# EasyEDA Pro project P1.epro

# Schematic 51board_Schematic
Board Name: Board1; Create Date: 2024-12-11; Page Name: P1; Project Name: 51board; Schematic Name: 51board_Schematic; Update Date: 2024-12-11; Company: DUOBAO; Drawed: yunshu; Page Size: A4; Version: V1.0
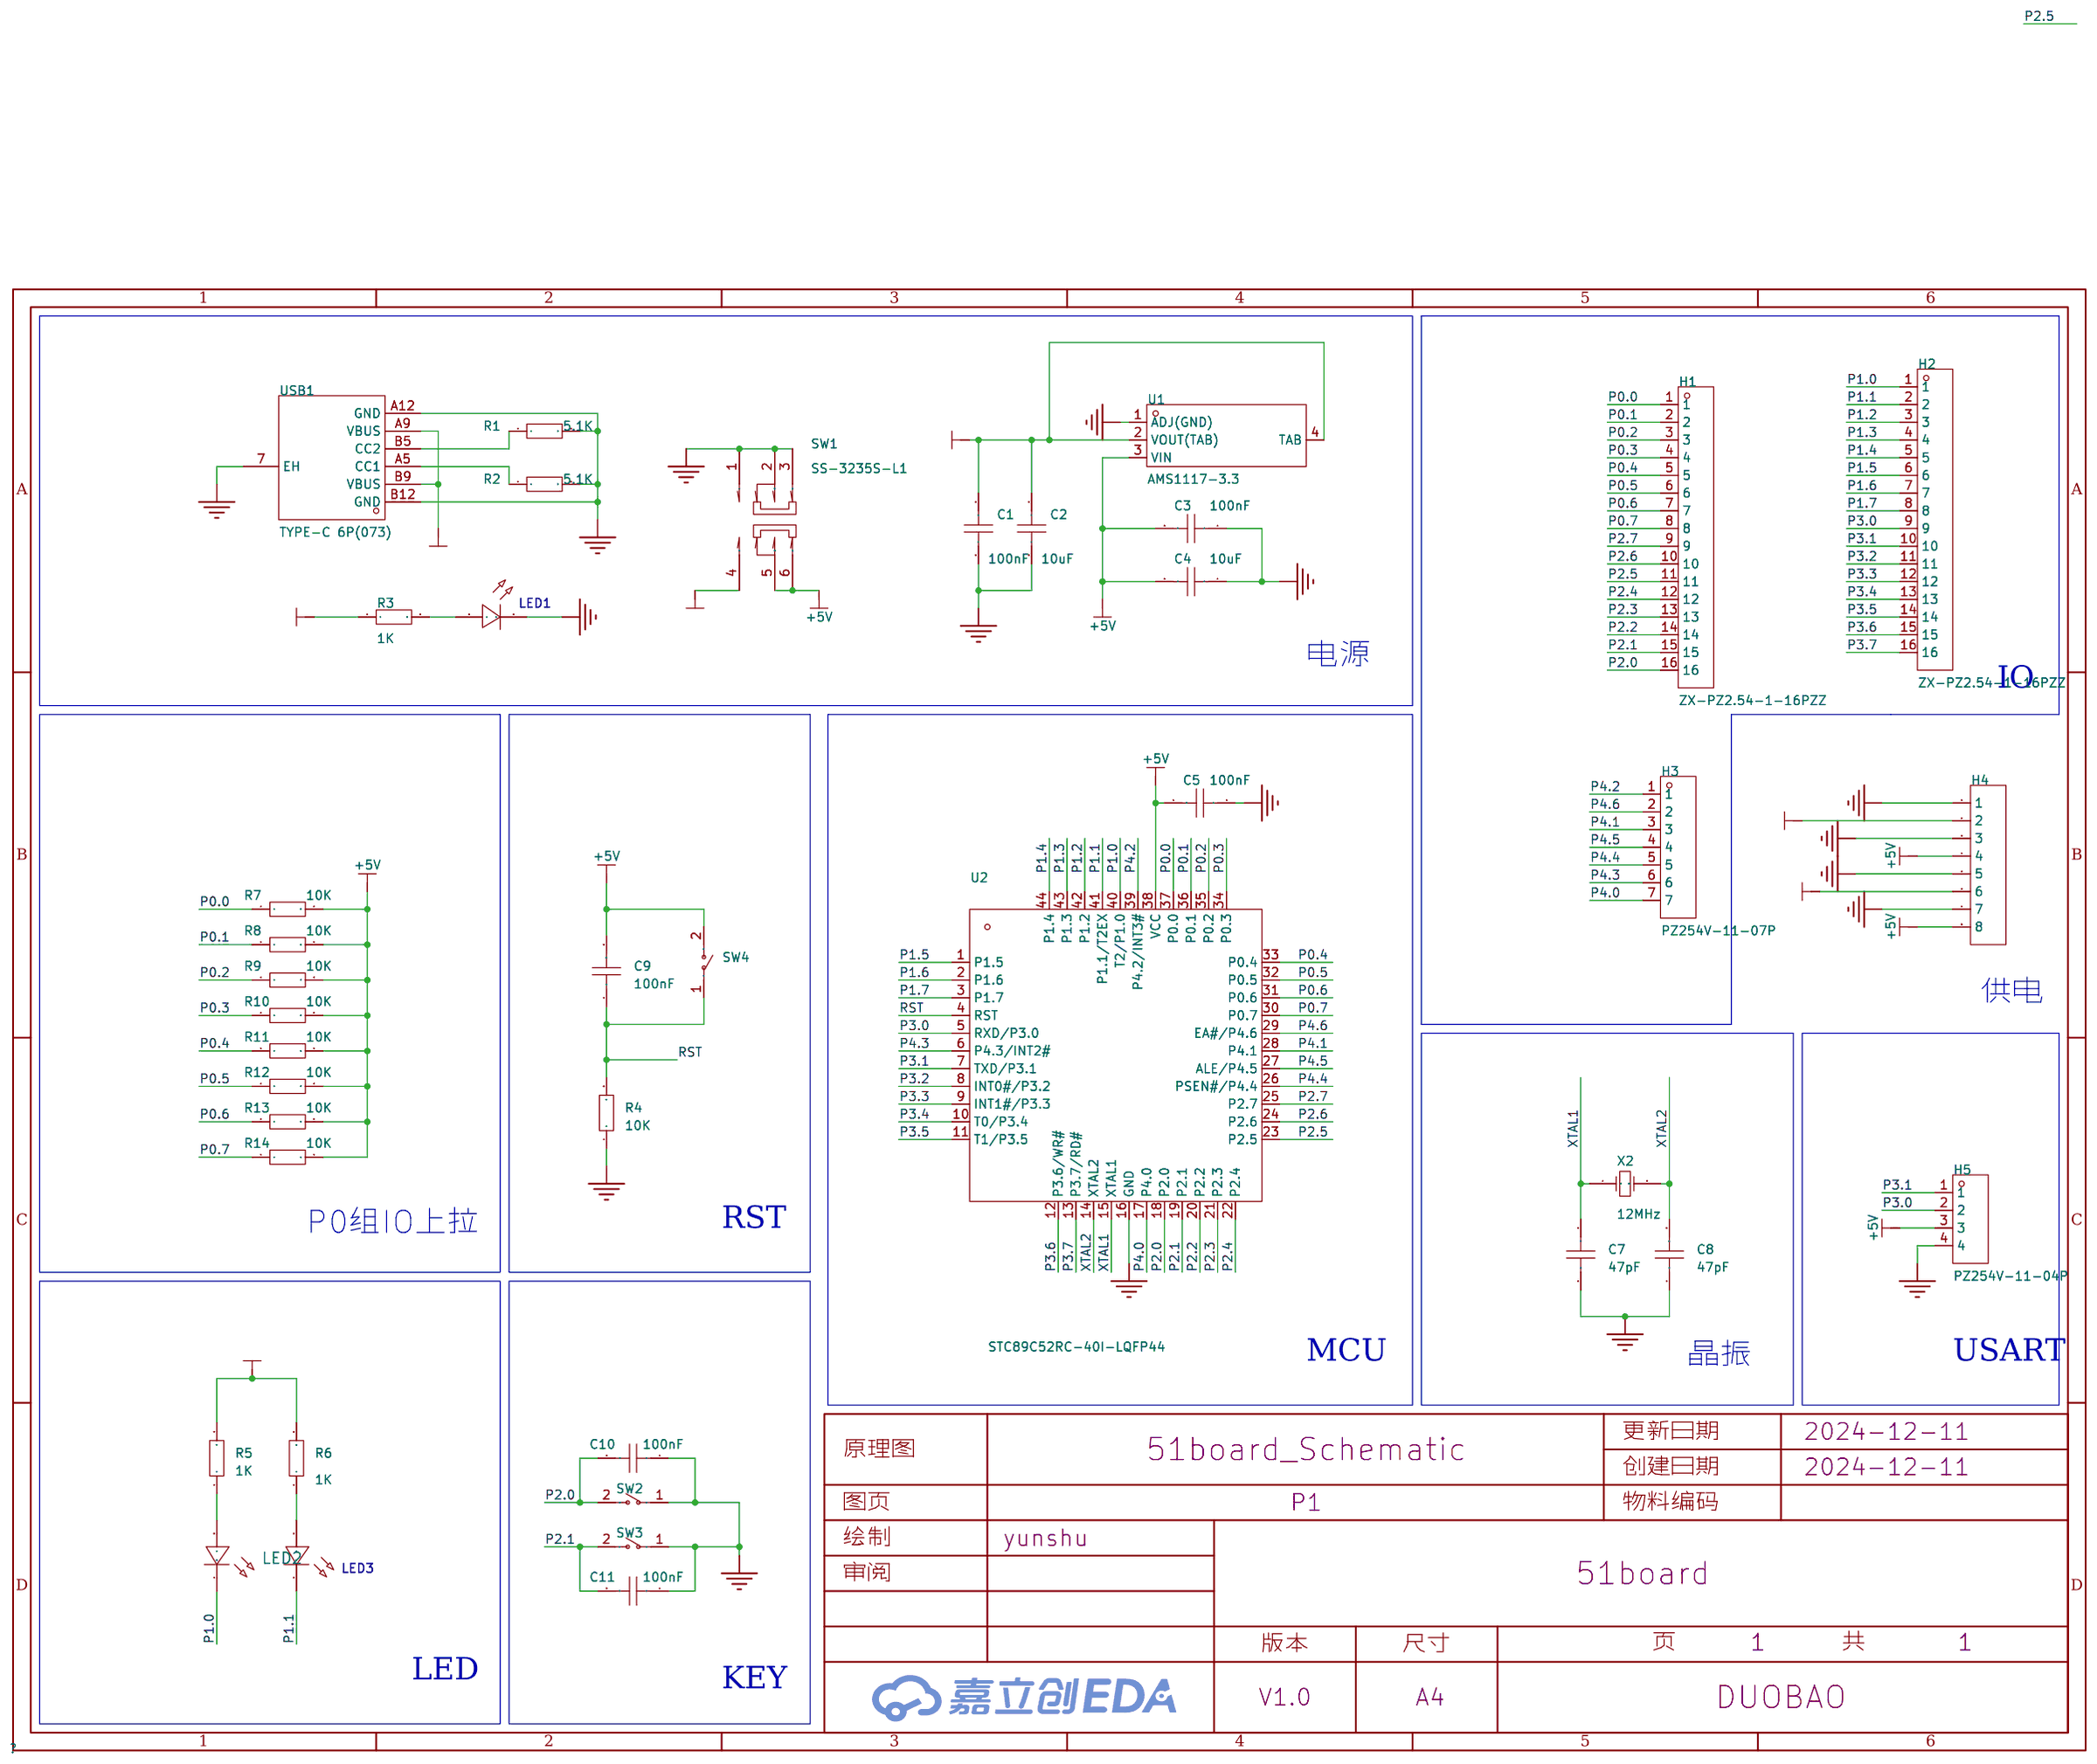
[diagram p0: schematic sheet]

## Parts
C1  100nF  [C0805]
C2  10uF  [C0805]
C3  100nF  [C0805]
C4  10uF  [C0805]
C5  100nF  [C0805]
C7  47pF  [C0805]
C8  47pF  [C0805]
C9  100nF  [C0805]
C10  100nF  [C0805]
C11  100nF  [C0805]
H1  ZX-PZ2.54-1-16PZZ  [HDR-TH_16P-P2.54-V-M-2]
H2  ZX-PZ2.54-1-16PZZ  [HDR-TH_16P-P2.54-V-M-2]
H3  PZ254V-11-07P  [HDR-TH_7P-P2.54-V-M]
H4  -  [HDR-TH_8P-P2.54-V-F-1]
H5  PZ254V-11-04P  [HDR-TH_4P-P2.54-V-M]
LED1  -  [LED_0805]
LED2  -  [LED_0805]
LED3  -  [LED_0805]
R1  5.1K  [R0805]
R2  5.1K  [R0805]
R3  1K  [R0805]
R4  10K  [R0805]
R5  1K  [R0805]
R6  1K  [R0805]
R7  10K  [R0805]
R8  10K  [R0805]
R9  10K  [R0805]
R10  10K  [R0805]
R11  10K  [R0805]
R12  10K  [R0805]
R13  10K  [R0805]
R14  10K  [R0805]
SW1  SS-3235S-L1  [SW-SMD_SS-3235S-LX]
SW2  轻触按键 3x6x2.5mm  [SW-SMD_L6.1-W3.7-LS8.0]
SW3  轻触按键 3x6x2.5mm  [SW-SMD_L6.1-W3.7-LS8.0]
SW4  轻触按键 3x6x2.5mm  [SW-SMD_L6.1-W3.7-LS8.0]
U1  AMS1117-3.3  [SOT-223-4_L6.5-W3.5-P2.30-LS7.0-BR]
U2  STC89C52RC-40I-LQFP44  [LQFP-44_L10.0-W10.0-P0.80-LS12.0-BL]
USB1  TYPE-C 6P(073)  [TYPE-C-SMD_TYPE-C-6P_5]
X2  12MHz  [OSC-TH_BD2.0-P0.50]

## Library data of the parts
C1-C5 C7-C11 = CAP_0805: Supplier Footprint: 0805
H1 H2 = ZX-PZ2.54-1-16PZZ: 插针结构:1x16P;间距:2.54mm;行距:-;圆针/方针:方针;安装类型:直插;排数:单排;总PIN位数:16P;额定电流:3A;额定电压:1kV;配合针长度:6mm;塑高:2.5mm;端接针长度:3mm;触头材质:黄铜;触头镀层:金;工作温度范围:-40℃~+105℃;焊接温度(最大值):-;颜色:黑色;; LCSC Part Name: 1x16P 间距:2.54mm 方针 直插; Supplier Part: C7501270; Manufacturer: Megastar(兆星); Supplier Footprint: 插件,P=2.54mm; JLCPCB Part Class: Extended Part; Datasheet: https://atta.szlcsc.com/upload/public/pdf/source/20231122/E454B24BEC0C004E7BA34E686CD1994E.pdf; Supplier: LCSC; Pin Structure: 1x16P; Pitch: 2.54mm; Circluar Pins/Square Pins: 方针; Mounting Type: 直插; Number of Rows: 单排; Number of Pins: 16P; Current Rating (Max): 3A; Voltage Rating (Max): 1kV; Length of Mating Pin: 6mm; Insulation Height: 2.5mm; Length of End Connection Pin: 3mm; Contact Material: 黄铜; Contact Plating: 金; Operating Temperature Range: -40℃~+105℃; Color: 黑色
H3 = PZ254V-11-07P: 插针结构:1x7P;间距:2.54mm;行距:-;圆针/方针:方针;安装类型:直插;排数:单排;总PIN位数:7P;额定电流:-;额定电压:-;配合针长度:6mm;塑高:2.5mm;端接针长度:3mm;触头材质:黄铜;触头镀层:-;工作温度范围:-40℃~+105℃;颜色:黑色;; LCSC Part Name: 间距:2.54mm 1x7P 直插 方针; Supplier Part: C492406; Manufacturer: XFCN(兴飞); Supplier Footprint: 插件,P=2.54mm; JLCPCB Part Class: Extended Part; Datasheet: https://atta.szlcsc.com/upload/public/pdf/source/20200309/C492406_654C533EE691117E22DD9F76C114C2D9.pdf; Supplier: LCSC; Pin Structure: 1x7P; Pitch: 2.54mm; Circluar Pins/Square Pins: 方针; Mounting Type: 直插; Number of Rows: 单排; Number of Pins: 7P; Length of Mating Pin: 6mm; Insulation Height: 2.5mm; Length of End Connection Pin: 3mm; Contact Material: 黄铜; Operating Temperature Range: -40℃~+105℃; Color: 黑色
H4 = HDR-F_2.54_1x8P: Supplier Part: C27438; Supplier Footprint: 插件
H5 = PZ254V-11-04P: 插针结构:1x4P;间距:2.54mm;行距:-;圆针/方针:方针;安装类型:直插;排数:单排;总PIN位数:4P;额定电流:3A;额定电压:250V;配合针长度:6mm;塑高:2.5mm;端接针长度:3mm;触头材质:-;工作温度范围:-40℃~+105℃;颜色:黑色;; LCSC Part Name: 间距:2.54mm 1x4P 直插 方针; Supplier Part: C2691448; Manufacturer: XFCN(兴飞); Supplier Footprint: 插件,P=2.54mm; JLCPCB Part Class: Extended Part; Datasheet: https://atta.szlcsc.com/upload/public/pdf/source/20200309/C492403_F9F19131791D08044AD4F84F8E751A34.pdf; Supplier: LCSC; Pin Structure: 1x4P; Pitch: 2.54mm; Circluar Pins/Square Pins: 方针; Mounting Type: 直插; Number of Rows: 单排; Number of Pins: 4P; Current Rating (Max): 3A; Voltage Rating (Max): 250V; Length of Mating Pin: 6mm; Insulation Height: 2.5mm; Length of End Connection Pin: 3mm; Operating Temperature Range: -40℃~+105℃; Color: 黑色
LED1 = LED_0805-G: Supplier Footprint: 0805
LED2 = LED_0805-R: Supplier Footprint: 0805
LED3 = LED_0805-B: Supplier Footprint: 0805
R1-R14 = Res_0805: Supplier Footprint: 0805
SW1 = SS-3235S-L1: 电路结构:双刀双掷;安装方式:卧贴;开关颜色:黑色;额定电流(DC):50mA;额定电压(DC):12V;额定电流(AC):50mA;额定电压(AC):12V;机械寿命:1万次;; LCSC Part Name: 柄长2mm 卧贴双档 滑动开关; Supplier Part: C500055; Manufacturer: XKB Connectivity(中国星坤); Supplier Footprint: SMD; JLCPCB Part Class: 扩展库; Datasheet: https://atta.szlcsc.com/upload/public/pdf/source/20211011/39D516E750C13BE9339464E723D9F132.pdf; Supplier: LCSC; Circuit: 双刀双掷; Actuator Style: 矩形柱状; Pin Style: 鸥翼型; Switch Length: 9.1mm; Switch Width: 3.55mm; Switch Height: 3.2mm; Mounting Style: 卧贴; Actuator Color: 黑色; Current Rating (DC): 50mA; Voltage Rating (DC): 12V; Current Rating (AC): 50mA; Voltage Rating (AC): 12V; Mechanical Life: 1万次; Operating Temperature: -40℃~+85℃
SW2-SW4 = 轻触按键 3x6x2.5mm_C5116372: 开关长度:6.05mm;开关宽度:3.65mm;开关高度:2.5mm;机械寿命:-;; Supplier Part: C5116372; Manufacturer: BBJ; Supplier Footprint: SMD; JLCPCB Part Class: 扩展库; Datasheet: https://atta.szlcsc.com/upload/public/pdf/source/20220725/9B611EB1AF8F1817AB348C1FCD97BDC0.pdf; Supplier: LCSC; Switch Length: 6.05mm; Switch Width: 3.65mm; Switch Height: 2.5mm
U1 = AMS1117-3.3_C347222: 输出类型:固定;最大输入电压:18V;输出电压:3.3V;输出电流:1A;电源纹波抑制比(PSRR):60dB@(120Hz);输出极性:正极;; LCSC Part Name: 输出:3.3V 电流:1A 耐压:12V; Supplier Part: C347222; Manufacturer: UMW(友台半导体); Supplier Footprint: SOT-223; JLCPCB Part Class: 扩展库; Datasheet: https://atta.szlcsc.com/upload/public/pdf/source/20231109/155D79A26D9DB04352555A58D5969DC8.pdf; Supplier: LCSC; Output Type: 固定; Maximum Input Voltage: 18V; Output Voltage: 3.3V; Output Current: 1A; Power Supply Rejection Ratio (PSRR): 60dB@(120Hz); Dropout Voltage: 1.3V@(1A); Feature: 过流保护(OCP); Output Polarity: 正极; Number of Outputs: 1
U2 = STC89C52RC-40I-LQFP44: CPU内核:51系列;程序存储容量:8KB;RAM总容量:512Byte;GPIO端口数量:39;工作电压范围:3.3V~5.5V;CPU最大主频:-;程序存储器类型:FLASH;; Supplier Part: C8707; Manufacturer: STC(宏晶); Supplier Footprint: LQFP-44(10x10); JLCPCB Part Class: 扩展库; Datasheet: https://atta.szlcsc.com/upload/public/pdf/source/20131218/1457706663573.pdf; Supplier: LCSC; CPU Core: 51系列; Program Storage Size: 8KB; RAM Size: 512Byte; GPIO Ports Number: 39; Operating Voltage Range: 3.3V~5.5V; Program Memory Type: FLASH; Operating Temperature Range: -40℃~+85℃; 16Bit Timer: 3; UART/USART: 1; Peripheral/Function: 看门狗; Watchdog: 有
USB1 = TYPE-C 6P(073): 连接器类型:Type-C;标准:USB 3.1;公母:母;安装方式:卧贴;触点数量:6P;端口数量:1;额定电流 - 电源:3A;工作温度范围:-25℃~+85℃;; LCSC Part Name: Type-C 母 卧贴; Supplier Part: C668623; Manufacturer: SHOU HAN(首韩); Supplier Footprint: SMD; JLCPCB Part Class: 扩展库; Datasheet: https://atta.szlcsc.com/upload/public/pdf/source/20200618/C668623_A4B260DED7AC1949BAC6AE39E9F4CD80.pdf; Supplier: LCSC; Connector Type: Type-C; Standard: USB 3.1; Gender: 母; Mounting Style: 卧贴; Number of Contacts: 6P; Number of Ports: 1; Current Rating - Power (Max): 3A; Operating Temperature Range: -25℃~+85℃; Rated Voltage (Max): 5V; Connect-Disconnect Life: 1万次; Core Colour: 黑色
X2 = TXD12M0002206LDBEO00S: 晶振类型:直插晶振;频率:12MHz;常温频差:±20ppm;外接负载电容:20pF;频率稳定度(全温):±30ppm;; LCSC Part Name: 12MHz ±20ppm 20pF; Supplier Part: C370892; Manufacturer: YJX(雅晶鑫); Supplier Footprint: DT-26; JLCPCB Part Class: 扩展库; Datasheet: https://atta.szlcsc.com/upload/public/pdf/source/20190212/C370892_CB1688440A1A1FED16C5B19E0C68FC7A.pdf; Supplier: LCSC; Crystal Type: 直插晶振; Normal temperature Frequency Tolerance: ±20ppm; External load capacitor: 20pF; Frequency Stability(Full temperature range): ±30ppm; Equivalent Series Resistance (ESR): 80Ω; Operating Temperature: -20℃~+70℃

## Nets
+5V: C3.2 C4.2 C5.1 C9.2 H4.4 H4.8 H5.3 R7.2 R8.2 R9.2 R10.2 R11.2 R12.2 R13.2 R14.2 SW1.5 SW1.6 SW4.2 U1.3(VIN) U2.38(VCC)
GND: C1.2 C2.2 C3.1 C4.1 C5.2 C7.1 C8.1 C10.1 C11.1 H4.1 H4.3 H4.5 H4.7 H5.4 LED1.1(C) R1.2 R2.2 R4.1 SW1.1 SW1.2 SW1.3 SW2.1 SW3.1 U1.1(ADJ(GND)) U2.16(GND) USB1.7(EH) USB1.A12(GND) USB1.B12(GND)
VCC+3.3V: C1.1 C2.1 H4.2 H4.6 R3.1 R5.2 R6.2 U1.2(VOUT(TAB)) U1.4(TAB)
VCC+5V: SW1.4 USB1.A9(VBUS) USB1.B9(VBUS)
P0.0: H1.1 R7.1 U2.37(P0.0)
P0.1: H1.2 R8.1 U2.36(P0.1)
P0.2: H1.3 R9.1 U2.35(P0.2)
P0.3: H1.4 R10.1 U2.34(P0.3)
P0.4: H1.5 R11.1 U2.33(P0.4)
P0.5: H1.6 R12.1 U2.32(P0.5)
P0.6: H1.7 R13.1 U2.31(P0.6)
P0.7: H1.8 R14.1 U2.30(P0.7)
P1.0: H2.1 LED2.1(C) U2.40(T2/P1.0)
P1.1: H2.2 LED3.1(C) U2.41(P1.1/T2EX)
P1.2: H2.3 U2.42(P1.2)
P1.3: H2.4 U2.43(P1.3)
P1.4: H2.5 U2.44(P1.4)
P1.5: H2.6 U2.1(P1.5)
P1.6: H2.7 U2.2(P1.6)
P1.7: H2.8 U2.3(P1.7)
P2.0: C10.2 H1.16 SW2.2 U2.18(P2.0)
P2.1: C11.2 H1.15 SW3.2 U2.19(P2.1)
P2.2: H1.14 U2.20(P2.2)
P2.3: H1.13 U2.21(P2.3)
P2.4: H1.12 U2.22(P2.4)
P2.5: H1.11 U2.23(P2.5)
P2.6: H1.10 U2.24(P2.6)
P2.7: H1.9 U2.25(P2.7)
P3.0: H2.9 H5.2 U2.5(RXD/P3.0)
P3.1: H2.10 H5.1 U2.7(TXD/P3.1)
P3.2: H2.11 U2.8(INT0#/P3.2)
P3.3: H2.12 U2.9(INT1#/P3.3)
P3.4: H2.13 U2.10(T0/P3.4)
P3.5: H2.14 U2.11(T1/P3.5)
P3.6: H2.15 U2.12(P3.6/WR#)
P3.7: H2.16 U2.13(P3.7/RD#)
P4.0: H3.7 U2.17(P4.0)
P4.1: H3.3 U2.28(P4.1)
P4.2: H3.1 U2.39(P4.2/INT3#)
P4.3: H3.6 U2.6(P4.3/INT2#)
P4.4: H3.5 U2.26(PSEN#/P4.4)
P4.5: H3.4 U2.27(ALE/P4.5)
P4.6: H3.2 U2.29(EA#/P4.6)
RST: C9.1 R4.2 SW4.1 U2.4(RST)
XTAL1: C7.2 U2.15(XTAL1) X2.1(OSC1)
XTAL2: C8.2 U2.14(XTAL2) X2.2(OSC2)
Net-(LED1-2): LED1.2(A) R3.2
Net-(LED2-2): LED2.2(A) R5.1
Net-(LED3-2): LED3.2(A) R6.1
Net-(R1-1): R1.1 USB1.B5(CC2)
Net-(R2-1): R2.1 USB1.A5(CC1)

## Notes on the sheet
- 电源
- IO
- 供电
- P0组IO上拉
- RST
- MCU
- 晶振
- USART
- LED
- KEY
